# EAGLE design basic-demodulator (EAGLE 7.7.0)
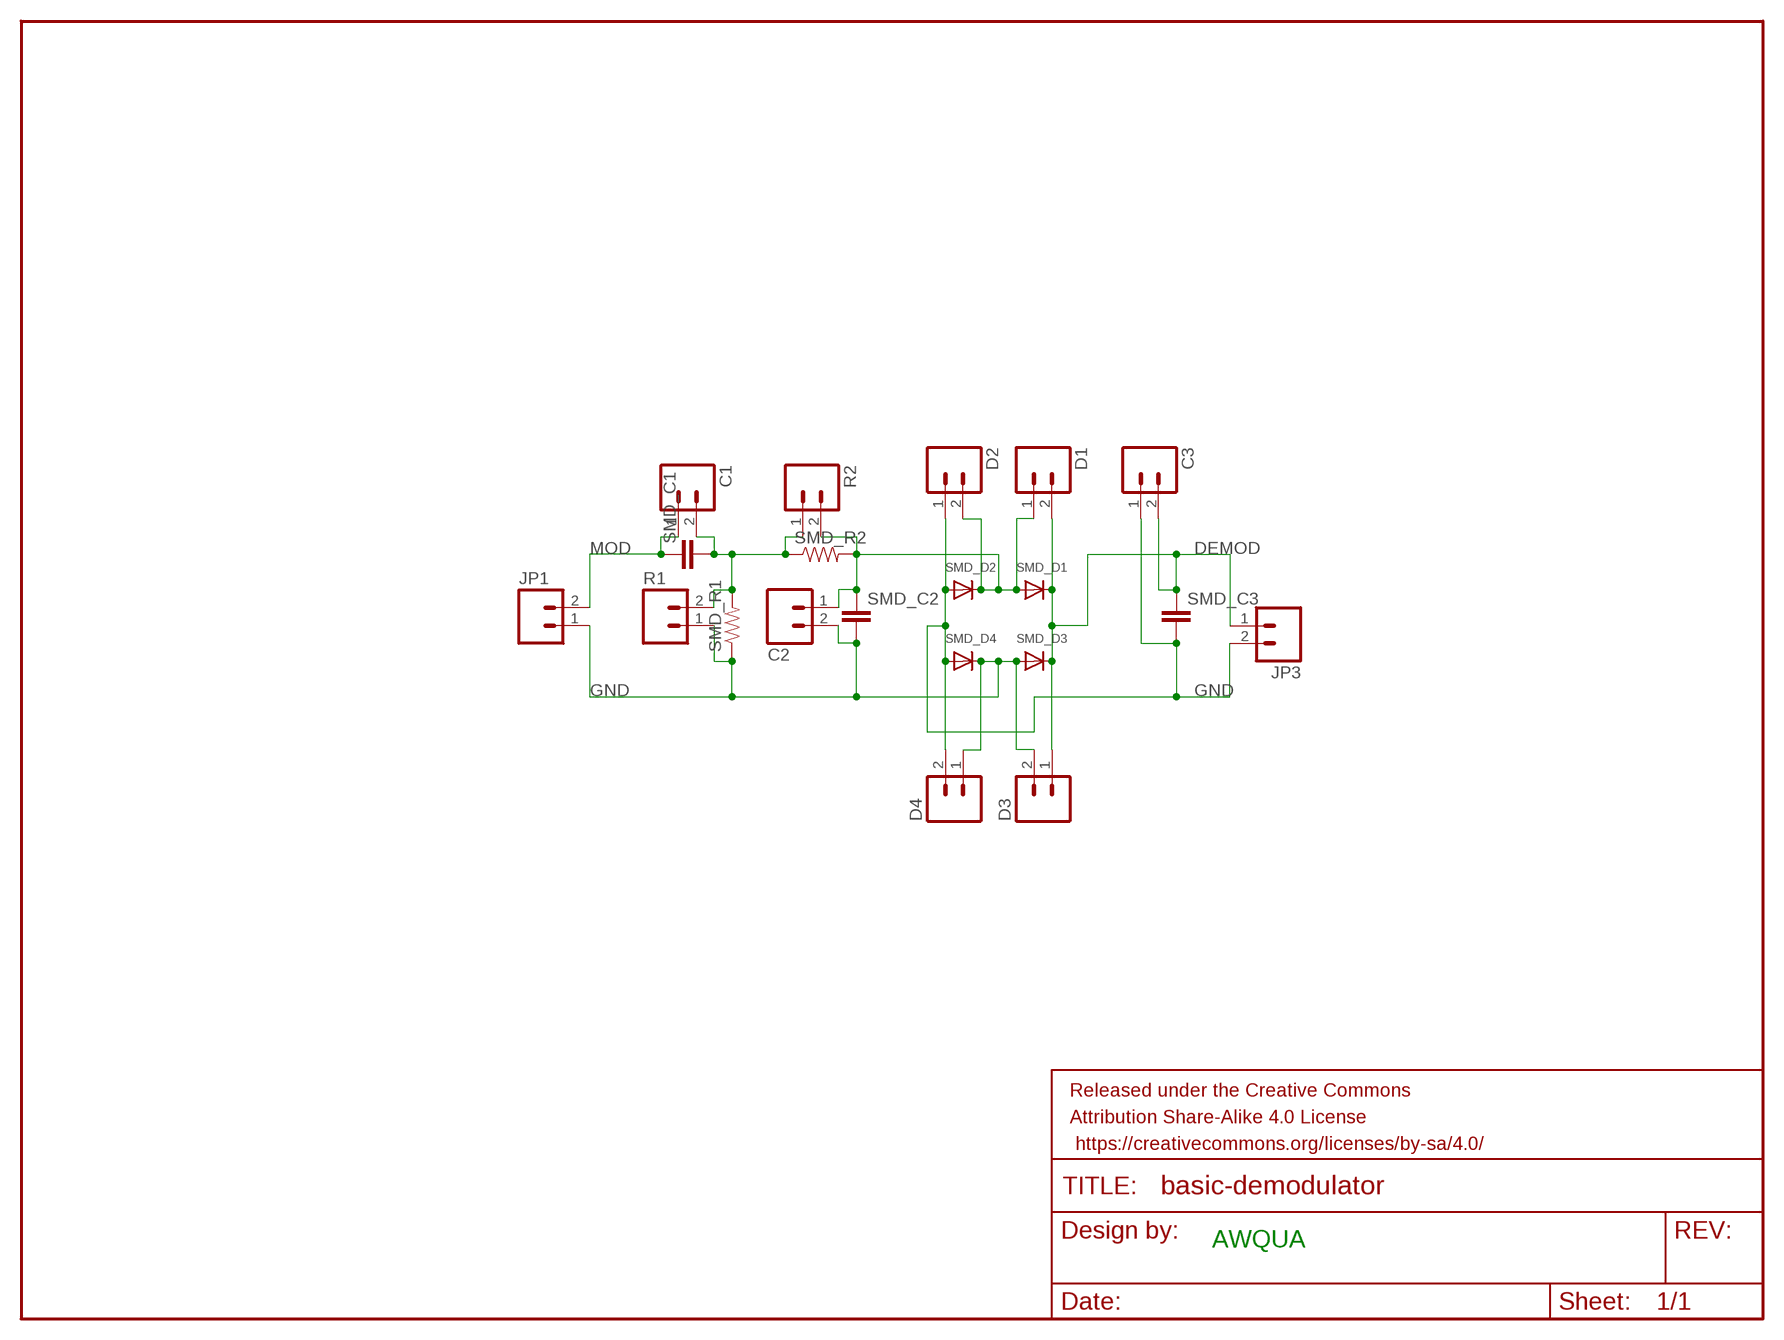
[diagram p0: schematic, sheet 1]

## Parts
C1  M02PTH  [1X02]
C2  M02PTH  [1X02]
C3  M02PTH  [1X02]
D1  M02PTH  [1X02]
D2  M02PTH  [1X02]
D3  M02PTH  [1X02]
D4  M02PTH  [1X02]
FRAME1  FRAME-LETTER  [CREATIVE_COMMONS]
JP1  M02PTH  [1X02]
JP3  M02PTH  [1X02]
R1  M02PTH  [1X02]
R2  M02PTH  [1X02]
SMD_C1  CAP0603-CAP  [0603-CAP]
SMD_C2  CAP0603-CAP  [0603-CAP]
SMD_C3  CAP0603-CAP  [0603-CAP]
SMD_D1  DIODESOD-123  [SOD-123]
SMD_D2  DIODESOD-123  [SOD-123]
SMD_D3  DIODESOD-123  [SOD-123]
SMD_D4  DIODESOD-123  [SOD-123]
SMD_R1  RESISTOR0603-RES  [0603-RES]
SMD_R2  RESISTOR0603-RES  [0603-RES]

## Nets
DEMOD: C3.2 D1.2 D3.1 JP3.1 SMD_C3.1 SMD_D1.C SMD_D3.C
GND: C2.2 C3.1 D2.1 D3.2 D4.1 D4.2 JP1.1 JP3.2 R1.1 SMD_C2.2 SMD_C3.2 SMD_D2.A SMD_D3.A SMD_D4.A SMD_D4.C SMD_R1.1
MOD: C1.1 JP1.2 SMD_C1.1
N$7: C1.2 R1.2 R2.1 SMD_C1.2 SMD_R1.2 SMD_R2.1
PRE_FWR: C2.1 D1.1 D2.2 R2.2 SMD_C2.1 SMD_D1.A SMD_D2.C SMD_R2.2

## Notes on the sheet
- AWQUA

## Library data of the parts
C1-C3 D1-D4 JP1 JP3 R1 R2 = SparkFun-Connectors:M02: Standard 2-pin 0.1" header. Use with - straight break away headers ( PRT-00116) - right angle break away headers (PRT-00553) - swiss pins (PRT-00743) - machine pins (PRT-00117) - female headers (PRT-00115) Molex polarized connector foot print use with: PRT-08233 with associated crimp pins and housings. 2.54_SCREWTERM for use with PRT-10571. 3.5mm Screw Terminal footprints for PRT-08084 5mm Screw Terminal footprints for use with PRT-08432
FRAME1 = SparkFun-Aesthetics:FRAME-LETTER: Schematic Frame Standard 8.5x11 US Letter frame
SMD_C1-SMD_C3 = SparkFun-Passives:CAP: Capacitor Standard 0603 ceramic capacitor, and 0.1" leaded capacitor.
SMD_D1-SMD_D4 = adafruit:DIODE: Diode SMADIODE - SMA Surface Mount Package 20V 1A Schottky Diode Digikey: 641-1014-6-ND DO-1N4148 - Through Hole Small Current Diode SOD-123 20V 1 A (.5mV Vf) Schottky Diode - Digikey: MBRX120TPMSCT-ND SOD-323 10V 570mA (.38mV Vf, 3ns) Schottky Diode - Digikey: ZLLS410CT-ND SOD-523 30V 30mA Schottky Diode (RB751S-40TE61) - Digikey: RB751S-40TE61CT-ND SOT23-R/W - SOT23 Package (R = Solder Paste/Reflow Ovens, W = Hand-Soldering) BAT54Film 40V 300mA - Digikey: 497-7162-1-ND
SMD_R1 SMD_R2 = SparkFun-Passives:RESISTOR: Resistor Basic schematic elements and footprints for 0603, 1206, and PTH resistors.

## Board
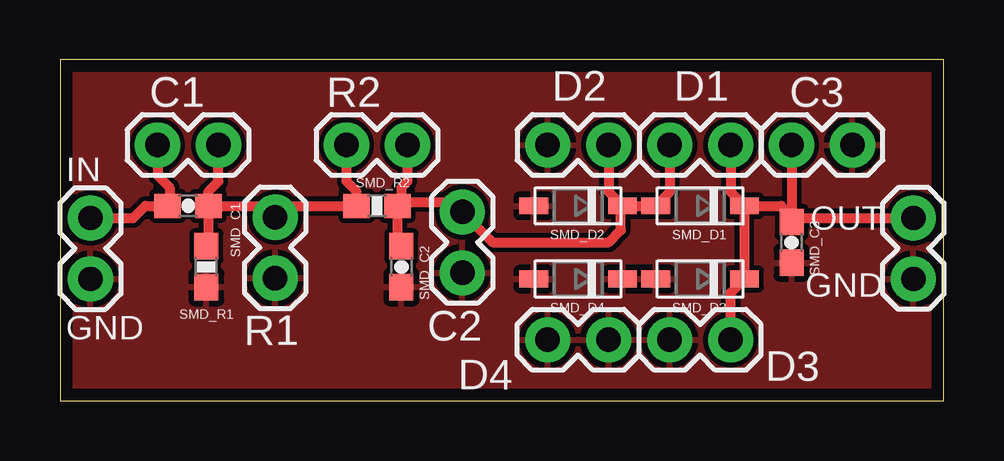
[diagram p1: board, top side]
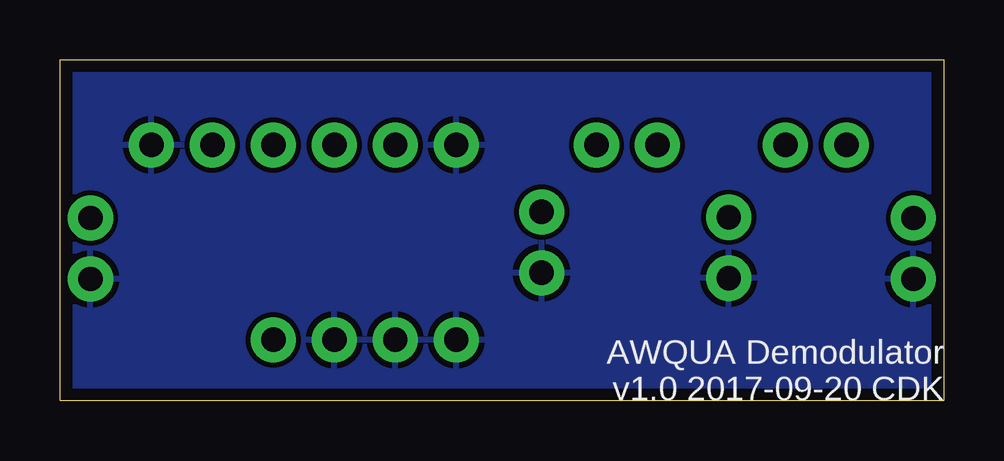
[diagram p2: board, bottom side, seen from below]

Size 36.83 x 14.21 mm. Coordinates in mm from the lower left corner, seen from the top.
Outline: 0,0 36.83,0 36.83,14.21 0,14.21 0,0
Copper layers (1*16): Top 0.035mm / dielectric 1.5mm / Bottom 0.035mm
Design rules "default *": minimum track width 10mil, minimum drill 13mil, track to track 8mil, track to pad 8mil, pad to pad 8mil, via to via 8mil, smd to smd 8mil, copper to edge 20mil, drill to drill 8mil, minimum pad ring 10mil, minimum via ring 8mil, stop-mask expansion 4mil, vias tented up to drill 13mil, thermal gap 10mil

### Footprints (pad centres in the part's own frame; a part is rotated, then mirrored left to right if it is on the bottom)
1X02 = drill 1.016 pad 1.88: 1 0,0; 2 2.54,0
0603-CAP = smd 1.1 x 1: 1 -0.85,0; 2 0.85,0
SOD-123 = smd 1.2 x 0.7: A 1.85,0; C -1.85,0
0603-RES = smd 1.1 x 1: 1 -0.85,0; 2 0.85,0

### Placement (x,y rotation side)
C1  4.06,10.67 0 top
C2  16.76,7.87 270 top
C3  33.02,10.67 180 top
D1  25.4,10.67 0 top
D2  20.32,10.67 0 top
D3  27.94,2.54 180 top
D4  22.86,2.54 180 top
FRAME1  -1.27,-11.18 0 top  (outside the outline)
JP1  1.27,5.08 90 top
JP3  35.56,7.62 270 top
R1  8.96,5.11 90 top
R2  11.94,10.67 0 top
SMD_C1  5.33,8.13 0 top
SMD_C2  14.22,5.59 270 top
SMD_C3  30.48,6.6 270 top
SMD_D1  26.67,8.13 180 top
SMD_D2  21.59,8.13 180 top
SMD_D3  26.67,5.08 180 top
SMD_D4  21.59,5.08 180 top
SMD_R1  6.1,5.59 90 top
SMD_R2  13.21,8.13 0 top

### Tracks (layer width: path | path; a pad name or v marks a point on that pad's centre or on a via)
DEMOD
  Top 0.406: D1.2 27.94,8.71 SMD_D1.C | SMD_D1.C SMD_D3.C 27.94,4.5 D3.1 | SMD_D1.C 30.06,8.13 SMD_C3.1 | SMD_C3.1 30.73,7.62 JP3.1 | C3.2 SMD_C3.1
GND
  pour Bottom: -3.81,34.29 44.2,34.04 44.2,-3.81 -4.06,-3.81
  pour Top: -3.05,33.27 44.96,33.02 44.96,-4.83 -3.3,-4.83
MOD
  Top 0.406: JP1.2 3.05,7.62 3.56,8.13 SMD_C1.1 4.57,8.22 4.57,8.89 4.06,9.4 C1.1
N$7
  Top 0.406: SMD_C1.2 6.18,6.53 SMD_R1.2 | SMD_C1.2 8.49,8.13 R1.2 8.96,7.69 9.4,8.13 SMD_R2.1 12.36,8.72 11.94,9.14 R2.1 | SMD_C1.2 6.18,8.72 6.6,9.14 C1.2
PRE_FWR
  Top 0.406: R2.2 14.48,9.14 14.22,8.89 14.22,8.29 | 14.22,8.29 SMD_R2.2 14.06,6.6 SMD_C2.1 | 14.22,8.29 16.34,8.29 C2.1 18.03,6.6 22.86,6.6 23.37,7.11 23.37,8.06 SMD_D2.C | D2.2 22.86,8.71 SMD_D2.C | SMD_D2.C SMD_D1.A 25.4,8.71 D1.1

### Text on the board
tPlace: IN | OUT | GND | GND
tNames: AWQUA
bNames: AWQUA Demodulator / v1.0 2017-09-20 CDK